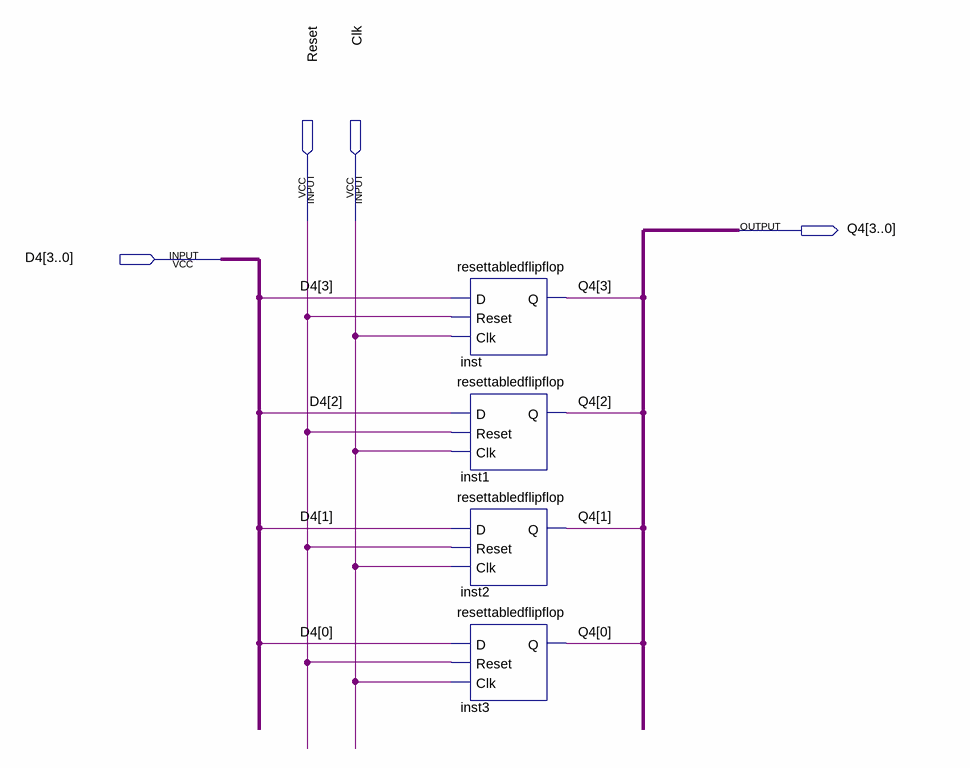
[diagram p0: schematic sheet]
// Quartus schematic register4.bdf as structural Verilog: 4 symbols, 4 pins
module register4 (
  input  Reset,
  input  Clk,
  input  [3:0] D4,
  output [3:0] Q4
);

  resettabledflipflop inst (.D(D4[3]), .Reset(Reset), .Clk(Clk), .Q(Q4[3]));
  resettabledflipflop inst1 (.D(D4[2]), .Reset(Reset), .Clk(Clk), .Q(Q4[2]));
  resettabledflipflop inst2 (.D(D4[1]), .Reset(Reset), .Clk(Clk), .Q(Q4[1]));
  resettabledflipflop inst3 (.D(D4[0]), .Reset(Reset), .Clk(Clk), .Q(Q4[0]));
endmodule
